# Altium schematic sheet [06] - CONNECTORS 1.SchDoc
size A3; DocumentNumber: 6; SheetNumber: 6; SheetTotal: 9
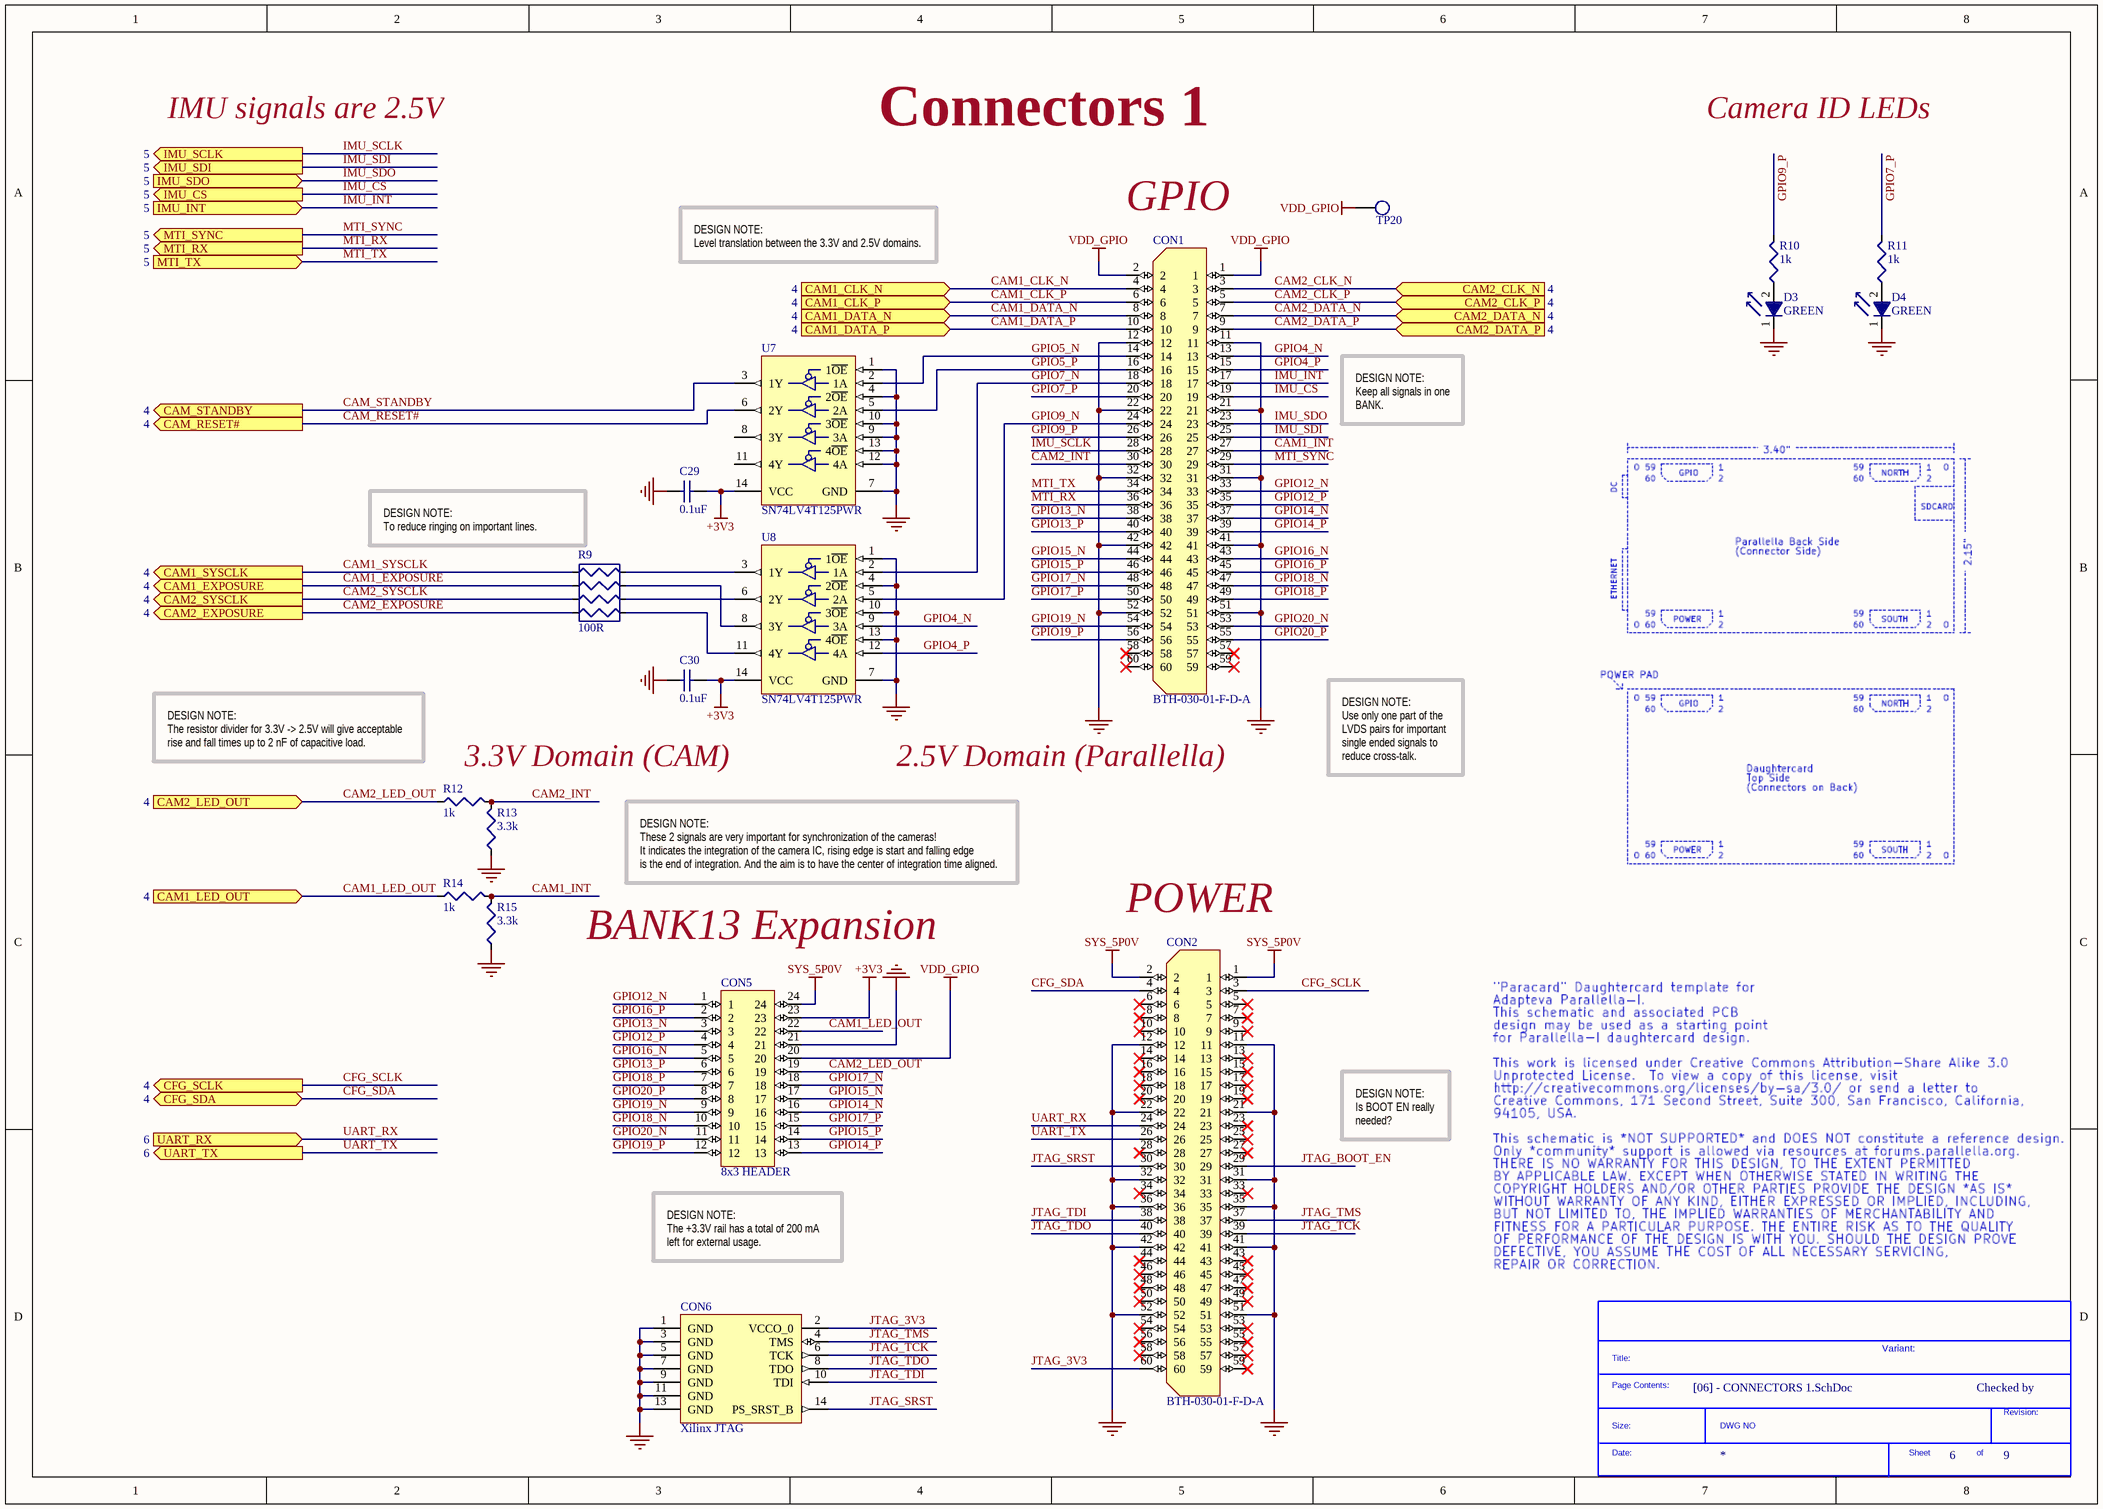
[diagram p0: [06] - CONNECTORS 1.SchDoc]

## Parts
*  SDTitleBlock  (value not drawn)  (graphical)
C29  0.1uF  [C0603L]
C30  0.1uF  [C0603L]
CON1  BTH-030-01-F-D-A  [BTH-030-01-X-D-A-K]
CON2  BTH-030-01-F-D-A  [BTH-030-01-X-D-A-K]
CON5  8x3 HEADER  [8x3HEADER_2.54mm]
CON6  Xilinx JTAG  [Xilinx JTAG Header]
D3  GREEN  [LED0603_GREEN]
D4  GREEN  [LED0603_GREEN]
R9  100R  [CAC-80P319X159-8L]
R10  1k  [R0603L]
R11  1k  [R0603L]
R12  1k  [R0603L]
R13  3.3k  [R0603L]
R14  1k  [R0603L]
R15  3.3k  [R0603L]
TP20  TestPoint  [TestPoint_1.5mm]  (value not drawn)  (no BOM)
U7  SN74LV4T125PWR  [TSSOP14N]
U8  SN74LV4T125PWR  [TSSOP14N]

## Ports
CAM1_CLK_N (in, see 4), CAM1_CLK_P (in, see 4), CAM1_DATA_N (in, see 4), CAM1_DATA_P (in, see 4), CAM1_EXPOSURE (out, see 4), CAM1_LED_OUT (in, see 4), CAM1_SYSCLK (out, see 4), CAM2_CLK_N (in, see 4), CAM2_CLK_P (in, see 4), CAM2_DATA_N (in, see 4), CAM2_DATA_P (in, see 4), CAM2_EXPOSURE (out, see 4), CAM2_LED_OUT (in, see 4), CAM2_SYSCLK (out, see 4), CAM_RESET# (out, see 4), CAM_STANDBY (out, see 4), CFG_SCLK (out, see 4), CFG_SDA (bidir, see 4), IMU_CS (out, see 5), IMU_INT (in, see 5), IMU_SCLK (out, see 5), IMU_SDI (out, see 5), IMU_SDO (in, see 5), MTI_RX (out, see 5), MTI_SYNC (out, see 5), MTI_TX (in, see 5), UART_RX (in, see 6), UART_TX (out, see 6)

## Nets
+3V3: C29.2 C30.2 CON5.23 U7.14(VCC) U8.14(VCC)
GND: C29.1 C30.1 CON1.11 CON1.12 CON1.21 CON1.22 CON1.31 CON1.32 CON1.41 CON1.42 CON1.51 CON1.52 CON2.11 CON2.12 CON2.21 CON2.22 CON2.31 CON2.32 CON2.35 CON2.36 CON2.41 CON2.42 CON2.51 CON2.52 CON5.21 CON6.1(GND) CON6.3(GND) CON6.5(GND) CON6.7(GND) CON6.9(GND) CON6.11(GND) CON6.13(GND) D3.1 D4.1 R13.1 R15.1 U7.1(1~{OE}) U7.4(2~{OE}) U7.7(GND) U7.9(3A) U7.10(3~{OE}) U7.12(4A) U7.13(4~{OE}) U8.1(1~{OE}) U8.4(2~{OE}) U8.7(GND) U8.10(3~{OE}) U8.13(4~{OE})
SYS_5P0V: CON2.1 CON2.2 CON5.24
VDD_GPIO: CON1.1 CON1.2 CON5.20 TP20.1
CAM1_CLK_N: CON1.4 ; port CAM1_CLK_N
CAM1_CLK_P: CON1.6 ; port CAM1_CLK_P
CAM1_DATA_N: CON1.8 ; port CAM1_DATA_N
CAM1_DATA_P: CON1.10 ; port CAM1_DATA_P
CAM1_EXPOSURE: R9.2 ; port CAM1_EXPOSURE
CAM1_INT: CON1.27 R14.2 R15.2
CAM1_LED_OUT: CON5.22 R14.1 ; port CAM1_LED_OUT
CAM1_SYSCLK: R9.1 ; port CAM1_SYSCLK
CAM2_CLK_N: CON1.3 ; port CAM2_CLK_N
CAM2_CLK_P: CON1.5 ; port CAM2_CLK_P
CAM2_DATA_N: CON1.7 ; port CAM2_DATA_N
CAM2_DATA_P: CON1.9 ; port CAM2_DATA_P
CAM2_EXPOSURE: R9.4 ; port CAM2_EXPOSURE
CAM2_INT: CON1.30 R12.2 R13.2
CAM2_LED_OUT: CON5.19 R12.1 ; port CAM2_LED_OUT
CAM2_SYSCLK: R9.3 ; port CAM2_SYSCLK
CAM_RESET#: U7.6(2Y) ; port CAM_RESET#
CAM_STANDBY: U7.3(1Y) ; port CAM_STANDBY
CFG_SCLK: CON2.3 ; port CFG_SCLK
CFG_SDA: CON2.4 ; port CFG_SDA
GPIO4_N: CON1.13 U8.9(3A)
GPIO4_P: CON1.15 U8.12(4A)
GPIO5_N: CON1.14 U7.2(1A)
GPIO5_P: CON1.16 U7.5(2A)
GPIO7_N: CON1.18 U8.2(1A)
GPIO7_P: CON1.20 R11.2
GPIO9_N: CON1.24 U8.5(2A)
GPIO9_P: CON1.26 R10.2
GPIO12_N: CON1.33 CON5.1
GPIO12_P: CON1.35 CON5.4
GPIO13_N: CON1.38 CON5.3
GPIO13_P: CON1.40 CON5.6
GPIO14_N: CON1.37 CON5.16
GPIO14_P: CON1.39 CON5.13
GPIO15_N: CON1.44 CON5.17
GPIO15_P: CON1.46 CON5.14
GPIO16_N: CON1.43 CON5.5
GPIO16_P: CON1.45 CON5.2
GPIO17_N: CON1.48 CON5.18
GPIO17_P: CON1.50 CON5.15
GPIO18_N: CON1.47 CON5.10
GPIO18_P: CON1.49 CON5.7
GPIO19_N: CON1.54 CON5.9
GPIO19_P: CON1.56 CON5.12
GPIO20_N: CON1.53 CON5.11
GPIO20_P: CON1.55 CON5.8
IMU_CS: CON1.19 ; port IMU_CS
IMU_INT: CON1.17 ; port IMU_INT
IMU_SCLK: CON1.28 ; port IMU_SCLK
IMU_SDI: CON1.25 ; port IMU_SDI
IMU_SDO: CON1.23 ; port IMU_SDO
JTAG_3V3: CON2.60 CON6.2(VCCO_0)
JTAG_BOOT_EN: CON2.29
JTAG_SRST: CON2.30 CON6.14(PS_SRST_B)
JTAG_TCK: CON2.39 CON6.6(TCK)
JTAG_TDI: CON2.38 CON6.10(TDI)
JTAG_TDO: CON2.40 CON6.8(TDO)
JTAG_TMS: CON2.37 CON6.4(TMS)
MTI_RX: CON1.36 ; port MTI_RX
MTI_SYNC: CON1.29 ; port MTI_SYNC
MTI_TX: CON1.34 ; port MTI_TX
UART_RX: CON2.24 ; port UART_RX
UART_TX: CON2.26 ; port UART_TX
NetD3_2: D3.2 R10.1
NetD4_2: D4.2 R11.1
NetR9_5: R9.5 U8.11(4Y)
NetR9_6: R9.6 U8.6(2Y)
NetR9_7: R9.7 U8.8(3Y)
NetR9_8: R9.8 U8.3(1Y)

Not connected (* = marked no-connect by the designer): CON1 57* 58* 59* 60*; CON2 5* 6* 7* 8* 9* 10* 13* 14* 15* 16* 17* 18* 19* 20* 23* 25* 27* 28* 33* 34* 43* 44* 45* 46* 47* 48* 49* 50* 53* 54* 55* 56* 57* 58* 59*; U7 8(3Y) 11(4Y)

## Notes on the sheet
- IMU signals are 2.5V
- Connectors 1
- Camera ID LEDs
- DESIGN NOTE:
  Level translation between the 3.3V and 2.5V domains.
- GPIO
- DESIGN NOTE:
  Keep all signals in one BANK.
- (near R9) DESIGN NOTE:
  To reduce ringing on important lines.
- DESIGN NOTE:
  The resistor divider for 3.3V -> 2.5V will give acceptable rise and fall times up to 2 nF of capacitive load.
- 3.3V Domain (CAM)
- 2.5V Domain (Parallella)
- DESIGN NOTE:
  Use only one part of the
  LVDS pairs for important
  single ended signals to
  reduce cross-talk.
- DESIGN NOTE:
  These 2 signals are very important for synchronization of the cameras!
  It indicates the integration of the camera IC, rising edge is start and falling edge
  is the end of integration. And the aim is to have the center of integration time aligned.
- POWER
- BANK13 Expansion
- DESIGN NOTE:
  Is BOOT EN really needed?
- DESIGN NOTE:
  The +3.3V rail has a total of 200 mA left for external usage.
- CLOCKS (CPU & PCIE)
- Variant:
- Checked by
- (in symbol SDTitleBlock) Title:; Page Contents:; Revision:; Size:; DWG NO; Date:; Sheet; of

## Library data of the parts
C29 C30 = GRM188R71H104KA93J: CAP CER 0.1UF 50V 10% X7R 0603; Manufacturer: Murata Electronics North America; Capacitance: 0.1µF; Supplier 1: Digi-Key; Manufacturer Part Number: GRM188R71H104KA93J; RoHS: RoHS Compliant; Category: Capacitors; Stock 1: 4487; Pricing 1: 1=0.12, 10=0.088, 50=0.048, 100=0.0405, 250=0.03316, 500=0.02838, 1000=0.02211, 5000=0.01843 (EUR); Packaging: Cut Tape (CT); Tolerance: ±10%; Voltage - Rated: 50V; Temperature Coefficient: X7R; Mounting Type: Surface Mount, MLCC; Operating Temperature: -55°C ~ 125°C; Applications: General Purpose; Ratings: -; Package / Case: 0603 (1608 Metric); Size / Dimension: 0.063" L x 0.031" W (1.60mm x 0.80mm); Height - Seated (Max): -; Thickness (Max): 0.035" (0.90mm); Lead Spacing: -; Features: -; Lead Style: -; ComponentLink1URL: http://www.murata.com/~/media/webrenewal/support/library/catalog/products/capacitor/mlcc/c02e.ashx; ComponentLink1Description: http://www.murata.com/~/media/webrenewal/support/library/catalog/products/capacitor/mlcc/c02e.ashx; Supplier Part Number 1: 490-9735-1-ND
CON1 CON2 = BTH-030-01-F-D-A: CONN RCPT 60POS 0.5MM SMD; Manufacturer: Samtec Inc; Connector Type: Socket, Center Strip Contacts; Number of Positions: 60; Pitch: 0.020" (0.50mm); Mated Stacking Heights: 5mm; Supplier 1: Digi-Key; Manufacturer Part Number: BTH-030-01-F-D-A; RoHS: RoHS Compliant; Category: Connectors, Interconnects; Stock 1: 0; Pricing 1: 1=5.93 (EUR); Packaging: Tray; Number of Rows: 2; Mounting Type: Surface Mount; Features: Board Guide; Contact Finish: Gold; Contact Finish Thickness: Flash; Height Above Board: 0.128" (3.25mm); ComponentLink1URL: http://www.samtec.com/ftppub/cpdf/BSH-XXX-01-X-D-XX-XX-MKT.pdf; ComponentLink1Description: http://www.samtec.com/ftppub/cpdf/BSH-XXX-01-X-D-XX-XX-MKT.pdf; Supplier Part Number 1: BTH-030-01-F-D-A-ND
D3 D4 = LTST-C190KGKT: LED GREEN CLEAR 0603 SMD; Manufacturer: Lite-On Inc; Wavelength - Dominant: 571nm; Wavelength - Peak: 574nm; Millicandela Rating: 35mcd; Voltage - Forward (Vf) (Typ): 2V; Current - Test: 20mA; Viewing Angle: 130°; Lens Color: Colorless; Lens Style/Size: Rectangle with Flat Top, 1.10mm x 0.80mm; Supplier 1: Digi-Key; Manufacturer Part Number: LTST-C190KGKT; RoHS: RoHS Compliant; Category: Optoelectronics; Stock 1: 508935; Pricing 1: 1=0.29, 10=0.223, 100=0.1216, 250=0.08108, 500=0.06892, 1000=0.0527 (EUR); Packaging: Cut Tape (CT); Color: Green; Lens Transparency: Clear; Package / Case: 0603 (1608 Metric); Supplier Device Package: *; Size / Dimension: 1.60mm L x 0.80mm W; Height (Max): 0.80mm; Mounting Type: Surface Mount; ComponentLink1URL: http://optoelectronics.liteon.com/upload/download/DS22-2000-074/S_110_LTST-C190KGKT.pdf; ComponentLink1Description: http://optoelectronics.liteon.com/upload/download/DS22-2000-074/S_110_LTST-C190KGKT.pdf; Supplier Part Number 1: 160-1435-1-ND
R9 = CAT16-101J4LF: RES ARRAY 100 OHM 4 RES 1206; Manufacturer: Bourns Inc.; Circuit Type: Isolated; Resistance (Ohms): 100; Tolerance: ±5%; Number of Resistors: 4; Power Per Element: 62.5mW; Temperature Coefficient: ±200ppm/°C; Supplier 1: Digi-Key; Manufacturer Part Number: CAT16-101J4LF; RoHS: RoHS Compliant; Category: Resistors; Stock 1: 10435; Pricing 1: 1=0.1, 10=0.067, 25=0.0636, 50=0.0602, 100=0.0522, 250=0.05072, 500=0.04586, 1000=0.04194 (EUR); Packaging: Cut Tape (CT); Number of Pins: 8; Operating Temperature: -55°C ~ 125°C; Applications: -; Mounting Type: Surface Mount; Package / Case: 1206 (3216 Metric), Concave, Long Side Terminals; Supplier Device Package: 1206; Size / Dimension: 0.126" L x 0.061" W (3.20mm x 1.55mm); Height: 0.024" (0.60mm); ComponentLink1URL: http://www.bourns.com/data/global/pdfs/CATCAY.pdf; ComponentLink1Description: http://www.bourns.com/data/global/pdfs/CATCAY.pdf; Supplier Part Number 1: CAT16-101J4LFCT-ND
R10-R12 R14 = CRCW06031K00FKEA: RES SMD 1K OHM 1% 1/10W 0603; Manufacturer: Vishay Dale; Power (Watts): 0.1W, 1/10W; Temperature Coefficient: ±100ppm/°C; Supplier 1: Digi-Key; Manufacturer Part Number: CRCW06031K00FKEA; RoHS: RoHS Compliant; Category: Resistors; Stock 1: 831888; Pricing 1: 10=0.077, 50=0.0416, 200=0.02385, 1000=0.01628 (EUR); Packaging: Cut Tape (CT); Resistance (Ohms): 1k; Tolerance: ±1%; Composition: Thick Film; Features: Automotive AEC-Q200; Operating Temperature: -55°C ~ 155°C; Package / Case: 0603 (1608 Metric); Supplier Device Package: 0603 (1608 Metric); Size / Dimension: 0.061" L x 0.033" W (1.55mm x 0.85mm); Height: 0.020" (0.50mm); Number of Terminations: 2; ComponentLink1URL: http://www.vishay.com/docs/20035/dcrcwe3.pdf; ComponentLink1Description: http://www.vishay.com/docs/20035/dcrcwe3.pdf; Supplier Part Number 1: 541-1.00KHCT-ND
R13 R15 = CRCW06033K30FKEA: RES 3.30K OHM 1/10W 1% 0603 SMD; Manufacturer: Vishay Dale; Power (Watts): 0.1W, 1/10W; Temperature Coefficient: ±100ppm/°C; Supplier 1: Digi-Key; Manufacturer Part Number: CRCW06033K30FKEA; RoHS: RoHS Compliant; Category: Resistors; Stock 1: 127044; Pricing 1: 10=0.077, 50=0.0412, 200=0.0236, 1000=0.01612 (EUR); Packaging: Cut Tape (CT); Resistance (Ohms): 3.3k; Tolerance: ±1%; Composition: Thick Film; Features: Automotive AEC-Q200 Qualified; Operating Temperature: -55°C ~ 155°C; Package / Case: 0603 (1608 Metric); Supplier Device Package: 0603 (1608 Metric); Size / Dimension: 0.061" L x 0.033" W (1.55mm x 0.85mm); Height: 0.020" (0.50mm); Number of Terminations: 2; ComponentLink1URL: http://www.vishay.com/docs/20035/dcrcwe3.pdf; ComponentLink1Description: http://www.vishay.com/docs/20035/dcrcwe3.pdf; Supplier Part Number 1: 541-3.30KHCT-ND
U7 U8 = SN74LV4T125PWR: IC BUFF/DVR NON-INVERT 14TSSOP; Manufacturer: Texas Instruments; Logic Type: Buffer/Line Driver, Non-Inverting; Number of Elements: 4; Number of Bits per Element: 1; Current - Output High, Low: 16mA, 16mA; Voltage - Supply: 1.6 V ~ 5.5 V; Supplier 1: Digi-Key; Manufacturer Part Number: SN74LV4T125PWR; RoHS: RoHS Compliant; Category: Integrated Circuits (ICs); Stock 1: 100; Pricing 1: 1=1.02, 10=0.899, 25=0.8112, 100=0.71, 250=0.6226, 500=0.55218, 750=0.48176, 1000=0.43668 (EUR); Packaging: Cut Tape (CT); Operating Temperature: -40°C ~ 125°C; Mounting Type: Surface Mount; Package / Case: 14-TSSOP (0.173", 4.40mm Width); Supplier Device Package: 14-TSSOP; ComponentLink1URL: http://www.ti.com/lit/ds/symlink/sn74lv4t125.pdf; ComponentLink1Description: http://www.ti.com/lit/ds/symlink/sn74lv4t125.pdf; Supplier Part Number 1: 296-40545-1-ND